# Altium schematic sheet Sheet2.SchDoc
size A
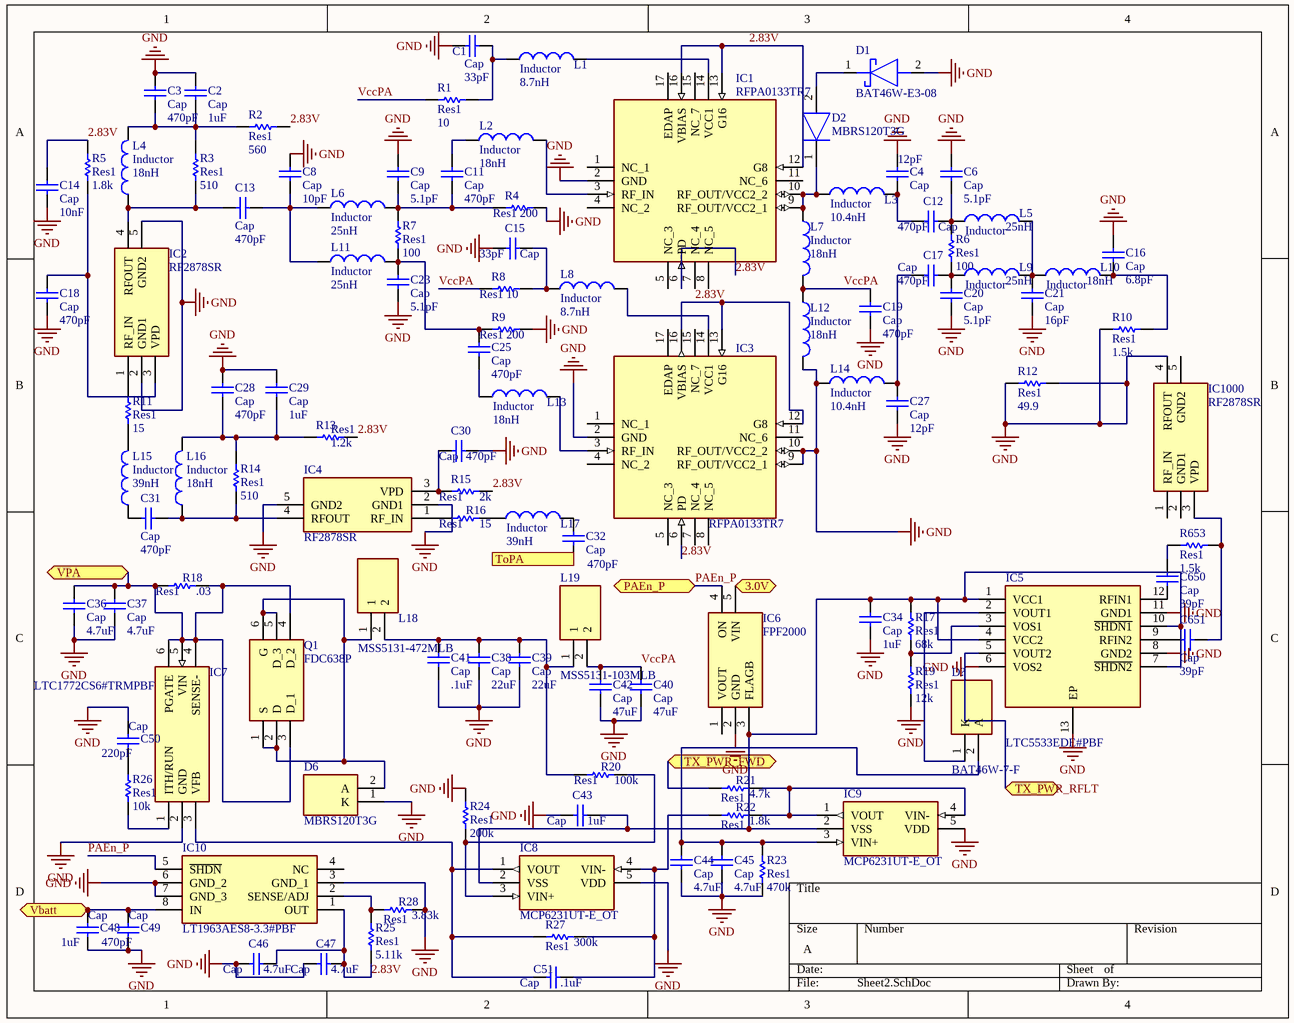
[diagram p0: Sheet2.SchDoc]

## Parts
C1  Cap  value 33pF  [0603]
C2  Cap  value 1uF  [0603]
C3  Cap  value 470pF  [0603]
C4  Cap  value 12pF  [0603]
C6  Cap  value 5.1pF  [0603]
C8  Cap  value 10pF  [0603]
C9  Cap  value 5.1pF  [0603]
C11  Cap  value 470pF  [0603]
C12  Cap  value 470pF  [0603]
C13  Cap  value 470pF  [0603]
C14  Cap  value 10nF  [0603]
C15  Cap  value 33pF  [0603]
C16  Cap  value 6.8pF  [0603]
C17  Cap  value 470pF  [0603]
C18  Cap  value 470pF  [0603]
C19  Cap  value 470pF  [0603]
C20  Cap  value 5.1pF  [0603]
C21  Cap  value 16pF  [0603]
C23  Cap  value 5.1pF  [0603]
C25  Cap  value 470pF  [0603]
C27  Cap  value 12pF  [0603]
C28  Cap  value 470pF  [0603]
C29  Cap  value 1uF  [0603]
C30  Cap  value 470pF  [0603]
C31  Cap  value 470pF  [0603]
C32  Cap  value 470pF  [0603]
C34  Cap  value 1uF  [0603]
C36  Cap  value 4.7uF  [0603]
C37  Cap  value 4.7uF  [0603]
C38  Cap  value 22uF  [0603]
C39  Cap  value 22uF  [0603]
C40  Cap  value 47uF  [0603]
C41  Cap  value .1uF  [0603]
C42  Cap  value 47uF  [0603]
C43  Cap  value 1uF  [0603]
C44  Cap  value 4.7uF  [0603]
C45  Cap  value 4.7uF  [0603]
C46  Cap  value 4.7uF  [0603]
C47  Cap  value 4.7uF  [0603]
C48  Cap  value 1uF  [0603]
C49  Cap  value 470pF  [0603]
C50  Cap  value 220pF  [0603]
C51  Cap  value .1uF  [0603]
C650  Cap  value 39pF  [0603]
C651  Cap  value 39pF  [0603]
D1  BAT46W-E3-08  [SOD3716X135N]
D2  MBRS120T3G  [DIOM5436X247N]
D6  MBRS120T3G  [DIOM5436X247N]
D?  BAT46W-7-F  [SOD3716X145N]
IC1  RFPA0133TR7  [QFN50P300X300X86-17N-D]
IC2  RF2878SR  [SOT95P280X159-5N]
IC3  RFPA0133TR7  [QFN50P300X300X86-17N-D]
IC4  RF2878SR  [SOT95P280X159-5N]
IC5  LTC5533EDE#PBF  [SON50P300X400X85-13N-D]
IC6  FPF2000  [SOT65P210X110-5N]
IC7  LTC1772CS6#TRMPBF  [SOT95P280X100-6N]
IC8  MCP6231UT-E_OT  [SOT95P270X145-5N]
IC9  MCP6231UT-E_OT  [SOT95P270X145-5N]
IC10  LT1963AES8-3.3#PBF  [SOIC127P599X175-8N]
IC1000  RF2878SR  [SOT95P280X159-5N]
L1  Inductor  value 8.7nH  [0603]
L2  Inductor  value 18nH  [0603]
L3  Inductor  value 10.4nH  [0603]
L4  Inductor  value 18nH  [0603]
L5  Inductor  value 25nH  [0603]
L6  Inductor  value 25nH  [0603]
L7  Inductor  value 18nH  [0603]
L8  Inductor  value 8.7nH  [0603]
L9  Inductor  value 25nH  [0603]
L10  Inductor  value 18nH  [0603]
L11  Inductor  value 25nH  [0603]
L12  Inductor  value 18nH  [0603]
L13  Inductor  value 18nH  [0603]
L14  Inductor  value 10.4nH  [0603]
L15  Inductor  value 39nH  [0603]
L16  Inductor  value 18nH  [0603]
L17  Inductor  value 39nH  [0603]
L18  MSS5131-472MLB  [MSS5131]
L19  MSS5131-103MLB  [MSS5131]
Q1  FDC638P  [SOT95P280X110-6N]
R1  Res1  value 10  [0603]
R2  Res1  value 560  [0603]
R3  Res1  value 510  [0603]
R4  Res1  value 200  [0603]
R5  Res1  value 1.8k  [0603]
R6  Res1  value 100  [0603]
R7  Res1  value 100  [0603]
R8  Res1  value 10  [0603]
R9  Res1  value 200  [0603]
R10  Res1  value 1.5k  [0603]
R11  Res1  value 15  [0603]
R12  Res1  value 49.9  [0603]
R13  Res1  value 1.2k  [0603]
R14  Res1  value 510  [0603]
R15  Res1  value 2k  [0603]
R16  Res1  value 15  [0603]
R17  Res1  value 68k  [0603]
R18  Res1  value .03  [0603]
R19  Res1  value 12k  [0603]
R20  Res1  value 100k  [0603]
R21  Res1  value 4.7k  [0603]
R22  Res1  value 1.8k  [0603]
R23  Res1  value 470k  [0603]
R24  Res1  value 200k  [0603]
R25  Res1  value 5.11k  [0603]
R26  Res1  value 10k  [0603]
R27  Res1  value 300k  [0603]
R28  Res1  value 3.83k  [0603]
R653  Res1  value 1.5k  [0603]

## Ports
3.0V (bidir), PAEn_P (bidir), ToPA (in), TX_PWR_FWD (bidir), TX_PWR_RFLT (bidir), Vbatt (bidir), VPA (bidir)

## Nets
GND: C1.1 C2.1 C3.1 C4.1 C6.1 C8.1 C9.1 C14.2 C15.1 C16.1 C18.2 C19.2 C20.2 C21.2 C23.2 C27.2 C28.1 C29.1 C30.2 C34.2 C36.2 C37.2 C38.2 C39.2 C40.2 C41.2 C42.2 C43.1 C44.2 C45.2 C46.2 C47.2 C48.2 C49.2 C50.1 D1.2(A) D6.1(K) IC1.2(GND) IC2.2(GND1) IC2.5(GND2) IC3.2(GND) IC3.9(RF_OUT/VCC2_1) IC3.10(RF_OUT/VCC2_2) IC4.2(GND1) IC4.5(GND2) IC5.6(VOS2) IC5.8(GND2) IC5.11(GND1) IC5.13(EP) IC6.2(GND) IC7.2(GND) IC8.5(VDD) IC9.5(VDD) IC10.3(GND_1) IC10.6(GND_2) IC10.7(GND_3) IC1000.4(RFOUT) L12.2 L14.1 R4.2 R9.2 R10.1 R12.1 R12.2 R19.2 R23.2 R24.1 R28.1
2.83V: C14.1 C46.1 C47.1 IC1.6(PD) IC1.12(G8) IC1.13(G16) IC1.16(VBIAS) IC3.6(PD) IC3.12(G8) IC3.13(G16) IC3.16(VBIAS) IC10.1(OUT) R2.2 R5.1 R13.1 R15.2 R25.2
3.0V: IC6.5(VIN) ; port 3.0V
PAEn_P: IC6.4(ON) IC10.5(~{SHDN}) ; port PAEn_P
ToPA: C32.2 ; port ToPA
TX_PWR_FWD: R21.2 ; port TX_PWR_FWD
TX_PWR_RFLT: IC5.5(VOUT2) ; port TX_PWR_RFLT
Vbatt: C48.1 C49.1 IC10.8(IN) ; port Vbatt
VccPA: C19.1 C40.1 C42.1 L7.2 L12.1 L19.2 R1.1 R8.1
VPA: C36.1 C37.1 IC7.4(SENSE-) IC7.5(VIN) IC7.6(PGATE) Q1.3(D_1) Q1.4(D_2) R18.1 R18.2 ; port VPA
NetC1_2: C1.2 L1.1 R1.2
NetC2_2: C2.2 C3.2 L4.2 R2.1 R3.1
NetC4_2: C4.2 C12.2 L3.2
NetC6_2: C6.2 C12.1 L5.1 R6.1
NetC8_2: C8.2 C13.2 L6.1 L11.1
NetC9_2: C9.2 C11.2 L6.2 R4.1 R7.1
NetC11_1: C11.1 L2.1
NetC13_1: C13.1 IC2.4(RFOUT) L4.1 R3.2
NetC15_2: C15.2 L8.1 R8.2
NetC16_2: C16.2 L10.2 R10.2
NetC17_1: C17.1 C20.1 L9.1 R6.2
NetC17_2: C17.2 C27.1 L14.2
NetC18_1: C18.1 IC2.3(VPD) R5.2
NetC21_1: C21.1 L5.2 L9.2 L10.1
NetC23_1: C23.1 C25.1 L11.2 R7.2 R9.1
NetC25_2: C25.2 L13.1
NetC28_2: C28.2 C29.2 L16.2 R13.2 R14.1
NetC30_1: C30.1 IC4.3(VPD) R15.1
NetC31_1: C31.1 L15.1
NetC31_2: C31.2 IC4.4(RFOUT) L16.1 R14.2
NetC32_1: C32.1 L17.2
NetC34_1: C34.1 C43.2 IC5.1(VCC1) IC5.4(VCC2) IC5.7(~{SHDN2}) IC5.10(~{SHDN1}) IC6.3(FLAGB) IC8.2(VSS) IC9.2(VSS) R17.1
NetC38_1: C38.1 C39.1 C41.1 L18.2 L19.1 R20.1
NetC44_1: C44.1 C45.1 D?.2(A) IC9.3(VIN+) R23.1
NetC50_2: C50.2 R26.1
NetC51_1: C51.1 IC7.3(VFB) IC8.1(VOUT) R27.2
NetC51_2: C51.2 IC8.4(VIN-) R22.2 R27.1
NetC650_1: C650.1 R653.1
NetC650_2: C650.2 IC5.12(RFIN1)
NetC651_1: C651.1 IC1000.3(VPD) R653.2
NetC651_2: C651.2 IC5.9(RFIN2)
NetD1_1: D1.1(K) D2.2(A)
NetD2_1: D2.1(K) IC1.9(RF_OUT/VCC2_1) IC1.10(RF_OUT/VCC2_2) L3.1 L7.1
NetD6_2: D6.2(A) L18.1 Q1.1(S) Q1.2(D) Q1.5(D_3) Q1.6(G)
NetD?_1: D?.1(K) IC5.2(VOUT1)
NetIC1_3: IC1.3(RF_IN) L2.2
NetIC1_14: IC1.14(VCC1) L1.2
NetIC2_1: IC2.1(RF_IN) R11.1
NetIC3_3: IC3.3(RF_IN) L13.2
NetIC3_14: IC3.14(VCC1) L8.2
NetIC4_1: IC4.1(RF_IN) R16.1
NetIC5_3: IC5.3(VOS1) R17.2 R19.1
NetIC7_1: IC7.1(ITH/RUN) R26.2
NetIC8_3: IC8.3(VIN+) R20.2 R24.2
NetIC9_1: IC9.1(VOUT) IC9.4(VIN-) R21.1 R22.1
NetIC10_2: IC10.2(SENSE/ADJ) R25.1 R28.2
NetL15_2: L15.2 R11.2
NetL17_1: L17.1 R16.2

Not connected (* = marked no-connect by the designer): IC1 1(NC_1) 4(NC_2) 5(NC_3) 7(NC_4) 8(NC_5) 11(NC_6) 15(NC_7) 17(EDAP); IC3 1(NC_1) 4(NC_2) 5(NC_3) 7(NC_4) 8(NC_5) 11(NC_6) 15(NC_7) 17(EDAP); IC6 1(VOUT); IC10 4(NC); IC1000 1(RF_IN) 2(GND1) 5(GND2)

## Library data of the parts
C1-C4 C6 C8 C9 C11-C21 C23 C25 C27-C32 C34 C36-C51 C650 C651 = Cap: Capacitor; Published: 8-Jun-2000; LatestRevisionDate: 17-Jul-2002; LatestRevisionNote: Re-released for DXP Platform.; PackageReference: RAD-0.3; Publisher: Altium Limited; PackageDescription: Radial Cap, Thru-Hole; 2 Leads; 0.3 in Pin Spacing
D1 = BAT46W-E3-08: Schottky Diode; Manufacturer_Name: Vishay; Datasheet Link: https://www.vishay.com/docs/85663/bat46wv.pdf; Height: 1.35mm; Manufacturer_Part_Number: BAT46W-E3-08; Mouser Part Number: 78-BAT46W-E3-08; Mouser Price/Stock: https://www.mouser.co.uk/ProductDetail/Vishay-Semiconductors/BAT46W-E3-08?qs=KP8Io%2FXyE5QAjvoG5XlHWA%3D%3D; RS Part Number: 7104493P; RS Price/Stock: http://uk.rs-online.com/web/p/products/7104493P
D2 D6 = MBRS120T3G: Diode; Manufacturer_Name: ON Semiconductor; Allied_Number: 70339713; Datasheet Link: http://www.onsemi.com/pub/Collateral/MBRS120T3-D.PDF; Height: 2.47mm; Manufacturer_Part_Number: MBRS120T3G; Mouser Part Number: 863-MBRS120T3G; RS Part Number: 5452068P; RS Price/Stock: http://uk.rs-online.com/web/p/products/5452068P; Allied Price/Stock: http://www.alliedelec.com/on-semiconductor-mbrs120t3g/70339713/
  D2: Mouser Price/Stock: https://www.mouser.co.uk/ProductDetail/ON-Semiconductor/MBRS120T3G?qs=3JMERSakebrTp9%2FFDiKL2w%3D%3D
  D6: Mouser Price/Stock: https://www.mouser.com/Search/Refine.aspx?Keyword=863-MBRS120T3G
D? = BAT46W-7-F: Diode; Manufacturer_Name: Diodes Inc.; Allied_Number: 71028110; Datasheet Link: https://componentsearchengine.com/Datasheets/2/BAT46W-7-F.pdf; Height: 1.45mm; Manufacturer_Part_Number: BAT46W-7-F; Mouser Part Number: 621-BAT46W-7-F; Mouser Price/Stock: https://www.mouser.com/Search/Refine.aspx?Keyword=621-BAT46W-7-F; RS Part Number: 7513373P; RS Price/Stock: http://uk.rs-online.com/web/p/products/7513373P; Allied Price/Stock: https://www.alliedelec.com/diodes-inc-bat46w-7-f/71028110/
IC1 IC3 = RFPA0133TR7: Integrated Circuit; Manufacturer_Name: Qorvo; Datasheet Link: http://www.qorvo.com/products/d/da000936; Height: 0.855mm; Manufacturer_Part_Number: RFPA0133TR7; Mouser Part Number: 772-RFPA0133; Mouser Price/Stock: https://www.mouser.com/Search/Refine.aspx?Keyword=772-RFPA0133
IC2 IC4 IC1000 = RF2878SR: Integrated Circuit; Manufacturer_Name: RFMD; Datasheet Link: https://datasheet.octopart.com/RF2878SR-RFMD-datasheet-17020116.pdf; Height: 1.59mm; Manufacturer_Part_Number: RF2878SR
IC5 = LTC5533EDE#PBF: Integrated Circuit; Manufacturer_Name: Linear Technology; Datasheet Link: https://componentsearchengine.com/Datasheets/2/LTC5533EDE#PBF.pdf; Height: 0.85mm; Manufacturer_Part_Number: LTC5533EDE#PBF
IC6 = FPF2000: Integrated Circuit; Manufacturer_Name: ON Semiconductor; Datasheet Link: https://www.onsemi.com/pub/Collateral/FPF2001-D.pdf; Height: 1.1mm; Manufacturer_Part_Number: FPF2000; Mouser Part Number: 512-FPF2000; Mouser Price/Stock: https://www.mouser.com/Search/Refine.aspx?Keyword=512-FPF2000; RS Part Number: 6709942P; RS Price/Stock: http://uk.rs-online.com/web/p/products/6709942P
IC7 = LTC1772CS6#TRMPBF: Integrated Circuit; Manufacturer_Name: Linear Technology; Datasheet Link: http://docs-emea.rs-online.com/webdocs/0ab8/0900766b80ab84d2.pdf; Height: 1mm; Manufacturer_Part_Number: LTC1772CS6#TRMPBF; Mouser Part Number: 584-LTC1772CS6TRMPBF; Mouser Price/Stock: https://www.mouser.com/Search/Refine.aspx?Keyword=584-LTC1772CS6TRMPBF; RS Part Number: 0411891; RS Price/Stock: http://uk.rs-online.com/web/p/products/0411891
IC8 IC9 = MCP6231UT-E_OT: Integrated Circuit; Manufacturer_Name: Microchip; Manufacturer_Part_Number: MCP6231UT-E/OT; Allied_Number: 70414221; Datasheet Link: http://ww1.microchip.com/downloads/en/DeviceDoc/21881e.pdf; Height: 1.45mm; Mouser Part Number: 579-MCP6231UT-E/OT; Mouser Price/Stock: https://www.mouser.com/Search/Refine.aspx?Keyword=579-MCP6231UT-E%2FOT; RS Part Number: 6674468; RS Price/Stock: https://uk.rs-online.com/web/p/products/6674468; Allied Price/Stock: http://www.alliedelec.com/microchip-technology-inc-mcp6231ut-e-ot/70414221/
IC10 = LT1963AES8-3.3#PBF: Integrated Circuit; Manufacturer_Name: Linear Technology; Datasheet Link: http://www.linear.com/docs/3709; Height: 1.752mm; Manufacturer_Part_Number: LT1963AES8-3.3#PBF; Mouser Part Number: 584-1963AES8-3.3PBF; Mouser Price/Stock: https://www.mouser.com/Search/Refine.aspx?Keyword=584-1963AES8-3.3PBF; RS Part Number: 7618550P; RS Price/Stock: http://uk.rs-online.com/web/p/products/7618550P
L1-L17 = Inductor: Code_IEC: 1005; Published: 8-Jun-2000; LatestRevisionDate: 29-May-2009; LatestRevisionNote: IPC-7351 Footprint Added.; PackageReference: 0402-A; Publisher: Altium Limited; PackageDescription: Chip Inductor; Code_JEITA: 0402
L18 = MSS5131-472MLB: Inductor; Manufacturer_Name: COILCRAFT; Datasheet Link: http://www.coilcraft.com/pdfs/mss5131.pdf; Manufacturer_Part_Number: MSS5131-472MLB; Mouser Part Number: 994-MSS5131-472MLB; Mouser Price/Stock: https://www.mouser.com/Search/Refine.aspx?Keyword=994-MSS5131-472MLB
L19 = MSS5131-103MLB: Inductor; Manufacturer_Name: COILCRAFT; Datasheet Link: https://componentsearchengine.com/Datasheets/1/MSS5131-103MLB.pdf; Manufacturer_Part_Number: MSS5131-103MLB; Mouser Part Number: 994-MSS5131-103MLB; Mouser Price/Stock: https://www.mouser.com/Search/Refine.aspx?Keyword=994-MSS5131-103MLB
Q1 = FDC638P: Integrated Circuit; Manufacturer_Name: ON Semiconductor; Datasheet Link: http://docs-emea.rs-online.com/webdocs/10e2/0900766b810e24f1.pdf; Height: 1.1mm; Manufacturer_Part_Number: FDC638P; Mouser Part Number: 512-FDC638P; Mouser Price/Stock: https://www.mouser.com/Search/Refine.aspx?Keyword=512-FDC638P; RS Part Number: 7614413; RS Price/Stock: https://uk.rs-online.com/web/p/products/7614413
R1-R28 R653 = Res1: Resistor; Published: 8-Jun-2000; LatestRevisionDate: 17-Jul-2002; LatestRevisionNote: Re-released for DXP Platform.; PackageReference: AXIAL-0.3; Publisher: Altium Limited; PackageDescription: Axial Device, Thru-Hole; 2 Leads; 0.3 in Pin Spacing